# EAGLE schematic ActiveHeadphone (EAGLE 6.2)
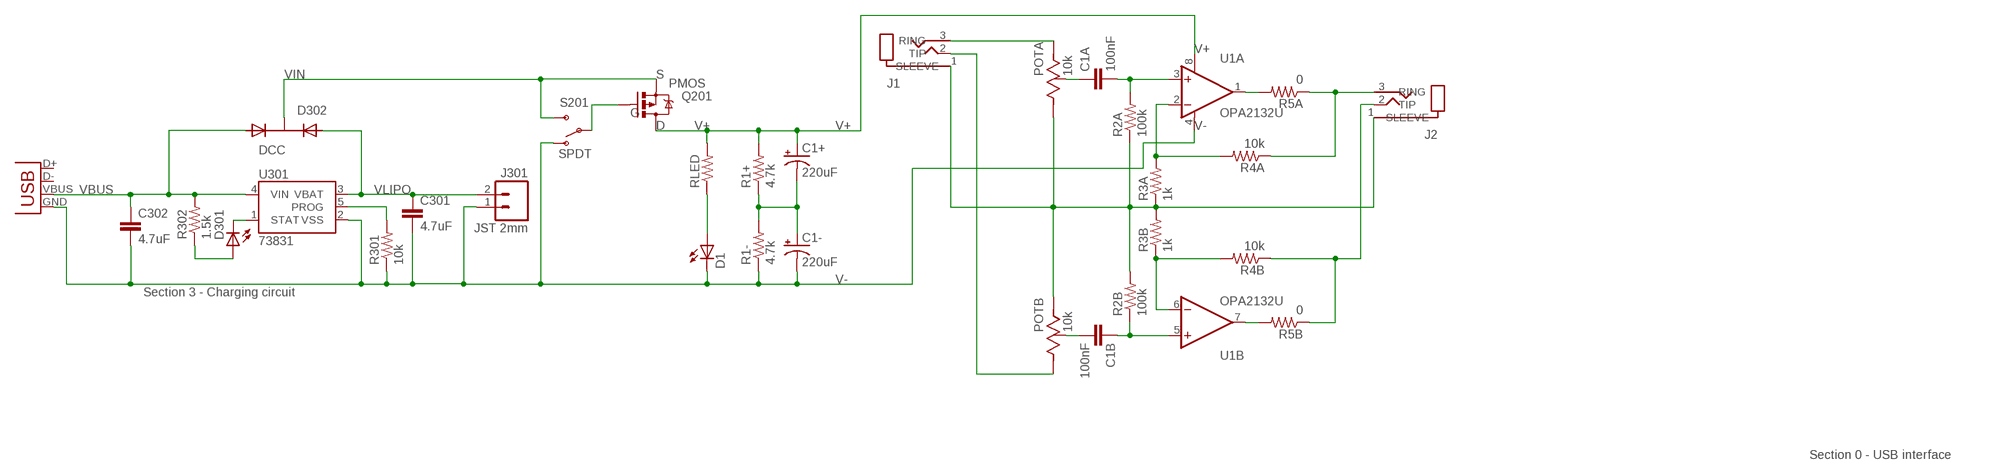
[diagram p0: schematic, sheet 1]

## Parts
C1+  220uF  CAP_POL7343  [EIA7343]
C1-  220uF  CAP_POL7343  [EIA7343]
C1A  100nF  CAP0603-CAP  [0603-CAP]
C1B  100nF  CAP0603-CAP  [0603-CAP]
C301  4.7uF  CAP0603-CAP  [0603-CAP]
C302  4.7uF  CAP0603-CAP  [0603-CAP]
D1  RED  LED0603  [LED-0603]
D301  RED  LED0603  [LED-0603]
D302  DCC  PMEG2005CT  [SOT-23-3]
J1  3.5mm  SJ1-3513-SMT  [SJ1-3513-SMT]
J2  3.5mm  SJ1-3513-SMT  [SJ1-3513-SMT]
J003  USBSMD  [USB-MINIB]
J301  JST 2mm  M02-JST-2MM-SMT  [JST-2-SMD]
POTA  10k  3352T  [3352T]
POTB  10k  3352T  [3352T]
Q201  PMOS  MOSFET-PCHANNELSMD  [SOT23-3]
R1+  4.7k  RESISTOR0603-RES  [0603-RES]
R1-  4.7k  RESISTOR0603-RES  [0603-RES]
R2A  100k  RESISTOR0603-RES  [0603-RES]
R2B  100k  RESISTOR0603-RES  [0603-RES]
R3A  1k  RESISTOR0603-RES  [0603-RES]
R3B  1k  RESISTOR0603-RES  [0603-RES]
R4A  10k  RESISTOR0603-RES  [0603-RES]
R4B  10k  RESISTOR0603-RES  [0603-RES]
R5A  0  RESISTOR0603-RES  [0603-RES]
R5B  0  RESISTOR0603-RES  [0603-RES]
R301  10k  RESISTOR0603-RES  [0603-RES]
R302  1.5k  RESISTOR0603-RES  [0603-RES]
RLED  RESISTOR0603-RES  [0603-RES]
S201  SPDT  SWITCH-SPSTSMD  [AYZ0202]
U1  OPA2132U  [SO08]
U301  73831  MCP73831  [SOT23-5]

## Nets
N$1: C1A.2 R2A.2 U1.3(A:+IN)
N$2: D1.A RLED.1
N$3: J2.3(RING) R4A.1 R5A.1
N$4: J1.3(RING) POTA.3(CW)
N$5: C1A.1 POTA.2(WIPER)
N$6: R5A.2 U1.1(A:OUT)
N$7: R3A.2 R4A.2 U1.2(A:-IN)
N$8: J1.2(TIP) POTB.1(CCW)
N$9: C1B.2 POTB.2(WIPER)
N$10: C1B.1 R2B.1 U1.5(B:+IN)
N$11: R3B.1 R4B.2 U1.6(B:-IN)
N$12: R5B.2 U1.7(B:OUT)
N$13: J2.2(TIP) R4B.1 R5B.1
N$14: R301.2 U301.5(PROG)
N$15: C1+.C(-) C1-.A(+) R1+.1 R1-.2
N$16: Q201.1(G) S201.2(P)
N$18: D301.A R302.1
N$19: D301.C U301.1(STAT)
V+: C1+.A(+) Q201.3(D) R1+.2 RLED.2 U1.8(A:V+)
V-: C1-.C(-) C301.2 C302.2 D1.C J003.GND J301.1 R1-.1 R301.1 S201.1(O) U1.4(A:V-) U301.2(VSS)
VBUS [power]: C302.1 D302.1(A1) J003.VBUS R302.2 U301.4(VIN)
VGND: J1.1(SLEEVE) J2.1(SLEEVE) POTA.1(CCW) POTB.3(CW) R2A.1 R2B.2 R3A.1 R3B.2
VIN: D302.3(K) Q201.2(S) S201.3(S)
VLIPO [power]: C301.1 D302.2(A2) J301.2 U301.3(VBAT)
Unconnected: J003.D+ J003.D-

## Notes on the sheet
- S
- G
- D
- Section 3 - Charging circuit
- Section 0 - USB interface

## Library data of the parts
C1+ C1- = SparkFun:CAP_POL: Capacitor Polarized These are standard SMD and PTH capacitors. Normally 10uF, 47uF, and 100uF in electrolytic and tantalum varieties. Always verify the external diameter of the through hole cap, it varies with capacity, voltage, and manufacturer. The EIA devices should be standard.; DIGIKEY: 399-5124-1-ND
C1A C1B C301 C302 = SparkFun:CAP: Capacitor Standard 0603 ceramic capacitor, and 0.1" leaded capacitor.
D1 D301 = SparkFun:LED: LEDs Standard schematic elements and footprints for 5mm, 3mm, 1206, and 0603 sized LEDs. 5mm - Spark Fun Electronics SKU : COM-00529 (and others)
D302 = KwanSystems:PMEG2005CT
J1 J2 = KwanSystems:SJ1-3513-SMT
J003 = SparkFun:USB: USB Connectors USB-B-PTH is fully proven SKU : PRT-00139 USB-miniB is fully proven SKU : PRT-00587 USB-A-PCB is untested. USB-A-H is throughly reviewed, but untested. Spark Fun Electronics SKU : PRT-00437 USB-B-SMT is throughly reviewed, but untested. Needs silkscreen touching up. USB-A-S has not been used/tested USB-MB-H has not been used/tested
J301 = SparkFun:M02: Header 2 Standard 2-pin 0.1" header. Use with straight break away headers (SKU : PRT-00116), right angle break away headers (PRT-00553), swiss pins (PRT-00743), machine pins (PRT-00117), and female headers (PRT-00115). Molex polarized connector foot print use with SKU : PRT-08233 with associated crimp pins and housings.
POTA POTB = KwanSystems:3352T
Q201 = SparkFun:MOSFET-PCHANNEL
R1+ R1- R2A R2B R3A R3B R4A R4B R5A R5B R301 R302 RLED = SparkFun:RESISTOR: Resistor Basic schematic elements and footprints for 0603, 1206, and PTH resistors.
S201 = SparkFun:SWITCH-SPST: SPST Switch Simple slide switch. Spark Fun Electronics SKU : COM-00102
U1 = burr-brown:OPA2132: High Speed FET-Input Operational Amplifiers< Product Folder:OPA2132; MF: TEXAS INSTRUMENTS; MPN: OPA2132U; OC_FARNELL: 1206934; OC_NEWARK: 80K6015
U301 = SparkFun:MCP73831: Microchip's MCP73831 Miniature single cell, fully integrated Li-Ion, Li-polymer charge management controller http://ww1.microchip.com/downloads/en/DeviceDoc/21984a.pdf

## Net classes
0 default: width 0.152 mm, drill 0.33 mm, clearance 0.152 mm
1 power: width 0.152 mm, drill 0.33 mm, clearance 0.152 mm to class 0, clearance 0.152 mm